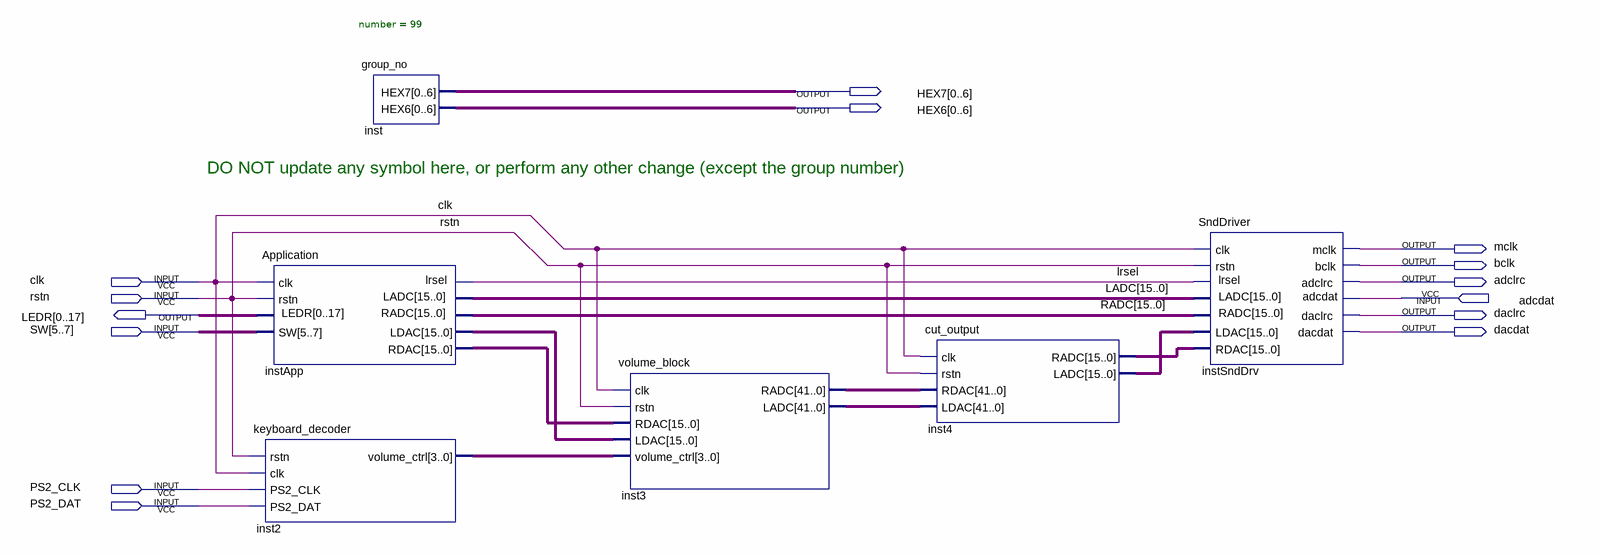
[diagram p0: schematic sheet]
// Quartus schematic Sound.bdf as structural Verilog: 6 symbols, 14 pins
module Sound (
  input  clk,
  input  rstn,
  input  adcdat,
  input  [5:7] SW,
  input  PS2_CLK,
  input  PS2_DAT,
  output [0:6] HEX7,
  output [0:6] HEX6,
  output mclk,
  output bclk,
  output adclrc,
  output [0:17] LEDR,
  output daclrc,
  output dacdat
);

  wire lrsel;
  wire [3:0] inst2_volume_ctrl;
  wire [15:0] inst4_ladc, inst4_radc, instApp_ldac, instApp_rdac, LADC, RADC;
  wire [41:0] inst3_ladc, inst3_radc;

  Application instApp (
    .clk(clk), .rstn(rstn), .SW(SW), .lrsel(lrsel), .LADC(LADC), .RADC(RADC), .LEDR(LEDR),
    .LDAC(instApp_ldac), .RDAC(instApp_rdac));
  keyboard_decoder inst2 (
    .rstn(rstn), .clk(clk), .PS2_CLK(PS2_CLK), .PS2_DAT(PS2_DAT), .volume_ctrl(inst2_volume_ctrl));
  group_no #(.number(99)) inst (.HEX7(HEX7), .HEX6(HEX6));
  volume_block inst3 (
    .clk(clk), .rstn(rstn), .RDAC(instApp_rdac), .LDAC(instApp_ldac), .volume_ctrl(inst2_volume_ctrl),
    .RADC(inst3_radc), .LADC(inst3_ladc));
  cut_output inst4 (.clk(clk), .rstn(rstn), .RDAC(inst3_radc), .LDAC(inst3_ladc), .RADC(inst4_radc), .LADC(inst4_ladc));
  SndDriver instSndDrv (
    .clk(clk), .rstn(rstn), .LDAC(inst4_ladc), .adcdat(adcdat), .RDAC(inst4_radc), .mclk(mclk), .bclk(bclk),
    .adclrc(adclrc), .daclrc(daclrc), .lrsel(lrsel), .LADC(LADC), .dacdat(dacdat), .RADC(RADC));

  // Notes on the sheet:
  //   DO NOT update any symbol here, or perform any other change (except the group number)
endmodule
